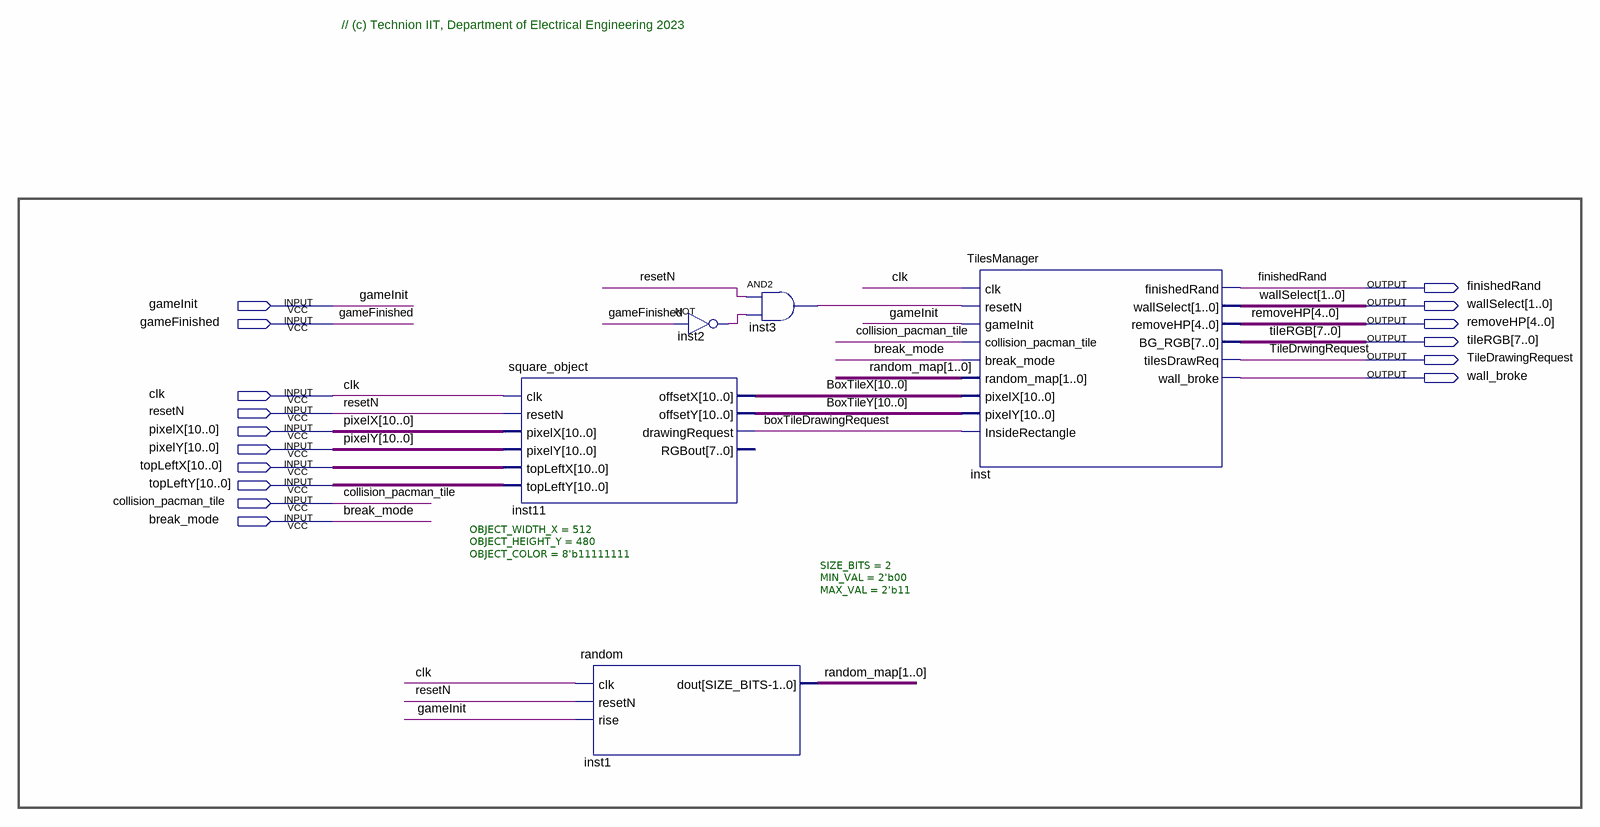
[diagram p0: schematic sheet]
// Quartus schematic TILES_DISPLAY.bdf as structural Verilog: 5 symbols, 16 pins
module TILES_DISPLAY (
  input  gameInit,
  input  gameFinished,
  input  clk,
  input  resetN,
  input  [10:0] pixelX,
  input  [10:0] pixelY,
  input  [10:0] topLeftX,
  input  [10:0] topLeftY,
  input  collision_pacman_tile,
  input  break_mode,
  output finishedRand,
  output [1:0] wallSelect,
  output [4:0] removeHP,
  output [7:0] tileRGB,
  output TileDrawingRequest,
  output wall_broke
);

  wire boxTileDrawingRequest, inst2_out, inst3_out;
  wire [1:0] random_map;
  wire [10:0] BoxTileX, BoxTileY;

  square_object #(.OBJECT_WIDTH_X(512), .OBJECT_HEIGHT_Y(480), .OBJECT_COLOR(8'b11111111)) inst11 (
    .clk(clk), .resetN(resetN), .pixelX(pixelX), .pixelY(pixelY), .topLeftX(topLeftX), .topLeftY(topLeftY),
    .offsetX(BoxTileX), .offsetY(BoxTileY), .drawingRequest(boxTileDrawingRequest));  // open: RGBout
  random #(.SIZE_BITS(2), .MIN_VAL(2'b00), .MAX_VAL(2'b11)) inst1 (
    .clk(clk), .resetN(resetN), .rise(gameInit), .dout(random_map));
  not inst2 (inst2_out, gameFinished);
  and inst3 (inst3_out, resetN, inst2_out);
  TilesManager inst (
    .clk(clk), .resetN(inst3_out), .gameInit(gameInit), .collision_pacman_tile(collision_pacman_tile),
    .break_mode(break_mode), .random_map(random_map), .pixelX(BoxTileX), .pixelY(BoxTileY),
    .InsideRectangle(boxTileDrawingRequest), .finishedRand(finishedRand), .wallSelect(wallSelect),
    .removeHP(removeHP), .BG_RGB(tileRGB), .tilesDrawReq(TileDrawingRequest), .wall_broke(wall_broke));

  // Other names for the same wires on the sheet: TileDrwingRequest = TileDrawingRequest

  // Notes on the sheet:
  //   // (c) Technion IIT, Department of Electrical Engineering 2023
endmodule
